# Altium project PCB_Project.PrjPcb
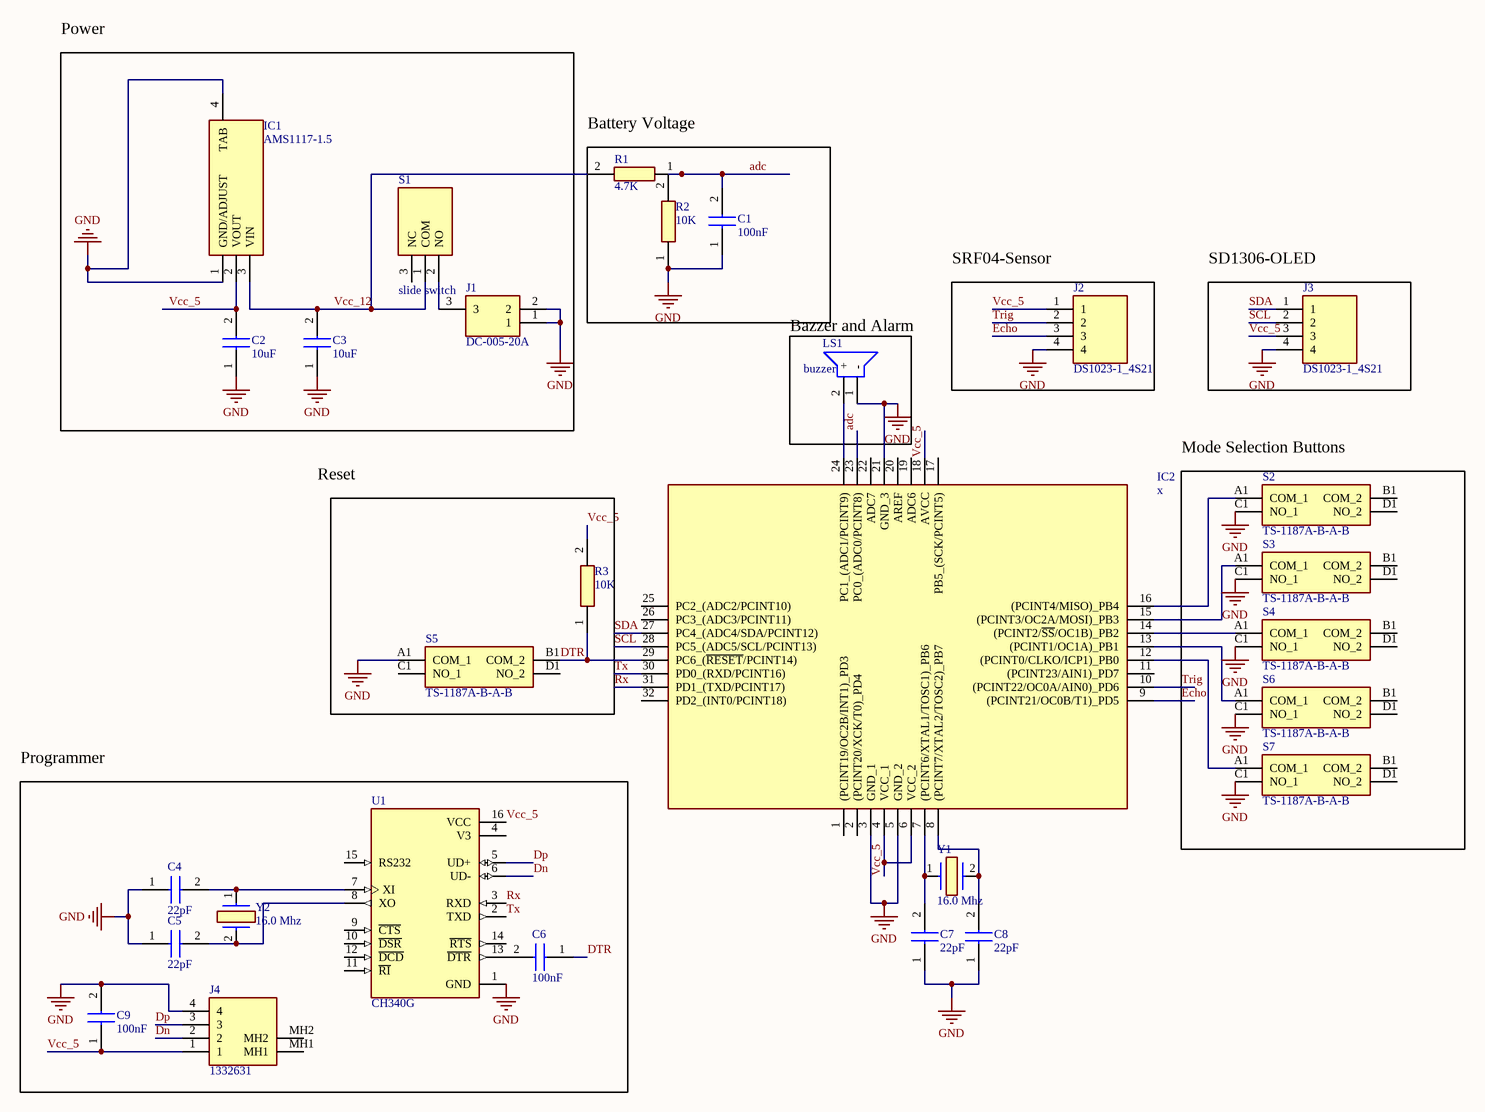
[diagram p0: Sheet1.SchDoc]
1 sheet, 29 parts. Net scope: global (net labels, ports and power ports of the same name join across sheets).
Board file: PCB1.PcbDoc

## Sheet Sheet1.SchDoc
size A3; SheetNumber: 1; SheetTotal: 1

### Parts
C1  100nF  [CAPC2012X130N]
C2  10uF  [CAPC2012X130N]
C3  10uF  [CAPC2012X130N]
C4  22pF  [CAPC2012X130N]
C5  22pF  [CAPC2012X130N]
C6  100nF  [CAPC2012X130N]
C7  22pF  [CAPC2012X130N]
C8  22pF  [CAPC2012X130N]
C9  100nF  [CAPC2012X130N]
IC1  AMS1117-1.5  [SOT229P700X180-4N]
IC2  x  [QFP80P900X900X120-32N]
J1  DC-005-20A  [DC00520A]
J2  DS1023-1_4S21  [RHDR4W60P0X254_1X4_1016X250X840P]
J3  DS1023-1_4S21  [RHDR4W60P0X254_1X4_1016X250X840P]
J4  1332631  [1332631]
LS1  buzzer  [CT1205SMTTR]
R1  4.7K  [RESC2012X60N]
R2  10K  [RESC2012X60N]
R3  10K  [RESC2012X60N]
S1  slide switch  [090329001]
S2  TS-1187A-B-A-B  [TS1187ABAB]
S3  TS-1187A-B-A-B  [TS1187ABAB]
S4  TS-1187A-B-A-B  [TS1187ABAB]
S5  TS-1187A-B-A-B  [TS1187ABAB]
S6  TS-1187A-B-A-B  [TS1187ABAB]
S7  TS-1187A-B-A-B  [TS1187ABAB]
U1  CH340G  [SOIC127P600X180-16N]
Y1  16.0 Mhz  [16000MHz49USMX3050408518pFATF]
Y2  16.0 Mhz  [16000MHz49USMX3050408518pFATF]

### Blocks framed on the sheet
Power: C2 C3 IC1 J1 S1
Battery Voltage: C1 R1 R2
SRF04-Sensor: J2
SD1306-OLED: J3
Bazzer and Alarm: LS1
Mode Selection Buttons: S2-S4 S6 S7
Programmer: C4-C6 C9 J4 U1 Y2

### Nets
GND: C1.1 C2.1 C3.1 C4.1 C5.1 C7.1 C8.1 C9.2 IC1.1(GND/ADJUST) IC1.4(TAB) IC2.3(GND_1) IC2.5(GND_2) IC2.21(GND_3) J1.1 J1.2 J2.4 J3.4 J4.4 LS1.1(-) R2.1 S2.C1(NO_1) S3.C1(NO_1) S4.C1(NO_1) S5.A1(COM_1) S6.C1(NO_1) S7.C1(NO_1) U1.1(GND)
adc: C1.2 IC2.23(PC0_(ADC0/PCINT8)) R1.1 R2.2
Dn: J4.2 U1.6(UD-)
Dp: J4.3 U1.5(UD+)
DTR: C6.1 IC2.29(PC6_(~{RESET}/PCINT14)) R3.1 S5.B1(COM_2)
Echo: IC2.9((PCINT21/OC0B/T1)_PD5) J2.3
Rx: IC2.31(PD1_(TXD/PCINT17)) U1.3(RXD)
SCL: IC2.28(PC5_(ADC5/SCL/PCINT13)) J3.2
SDA: IC2.27(PC4_(ADC4/SDA/PCINT12)) J3.1
Trig: IC2.10((PCINT22/OC0A/AIN0)_PD6) J2.2
Tx: IC2.30(PD0_(RXD/PCINT16)) U1.2(TXD)
Vcc_5: C2.2 C9.1 IC1.2(VOUT) IC2.4(VCC_1) IC2.6(VCC_2) IC2.18(AVCC) J2.1 J3.3 J4.1 R3.2 U1.16(VCC)
Vcc_12: C3.2 IC1.3(VIN) R1.2 S1.1(COM)
NetC4_2: C4.2 U1.7(XI) Y2.1
NetC5_2: C5.2 U1.8(XO) Y2.2
NetC6_2: C6.2 U1.13(~{DTR})
NetC7_2: C7.2 IC2.7((PCINT6/XTAL1/TOSC1)_PB6) Y1.1
NetC8_2: C8.2 IC2.8((PCINT7/XTAL2/TOSC2)_PB7) Y1.2
NetIC2_12: IC2.12((PCINT0/CLKO/ICP1)_PB0) S7.A1(COM_1)
NetIC2_13: IC2.13((PCINT1/OC1A)_PB1) S6.A1(COM_1)
NetIC2_14: IC2.14((PCINT2/~{SS}/OC1B)_PB2) S4.A1(COM_1)
NetIC2_15: IC2.15((PCINT3/OC2A/MOSI)_PB3) S3.A1(COM_1)
NetIC2_16: IC2.16((PCINT4/MISO)_PB4) S2.A1(COM_1)
NetIC2_24: IC2.24(PC1_(ADC1/PCINT9)) LS1.2(+)
NetJ1_3: J1.3 S1.2(NO)

Not connected (* = marked no-connect by the designer): IC2 1((PCINT19/OC2B/INT1)_PD3) 2((PCINT20/XCK/T0)_PD4) 11((PCINT23/AIN1)_PD7) 17(PB5_(SCK/PCINT5)) 19(ADC6) 20(AREF) 22(ADC7) 25(PC2_(ADC2/PCINT10)) 26(PC3_(ADC3/PCINT11)) 32(PD2_(INT0/PCINT18)); J4 MH1 MH2; S1 3(NC); S2 B1(COM_2) D1(NO_2); S3 B1(COM_2) D1(NO_2); S4 B1(COM_2) D1(NO_2); S5 C1(NO_1) D1(NO_2); S6 B1(COM_2) D1(NO_2); S7 B1(COM_2) D1(NO_2); U1 4(V3) 9(~{CTS}) 10(~{DSR}) 11(~{RI}) 12(~{DCD}) 14(~{RTS}) 15(RS232)

### Notes on the sheet
- Reset

### Library data of the parts
C1-C3 = 0805Y1000104KET: Capacitor; Manufacturer_Name: Knowles; Datasheet Link: http://docs-europe.electrocomponents.com/webdocs/119d/0900766b8119d7bc.pdf; Height: 1.3mm; Manufacturer_Part_Number: 0805Y1000104KET; Mouser Part Number: 843-0805Y1000104KET; Mouser Price/Stock: https://www.mouser.co.uk/ProductDetail/Knowles-Syfer/0805Y1000104KET?qs=HXFqYaX1Q2z9U%252BCIptEEYw%3D%3D
C4-C9 = 0805J050_0223MXE01: Capacitor; Manufacturer_Name: Knowles; Manufacturer_Part_Number: 0805J050 0223MXE01; Datasheet Link: http://docs-europe.electrocomponents.com/webdocs/119d/0900766b8119d7bc.pdf; Height: 1.3mm
IC1 = AMS1117-1.5: Integrated Circuit; Manufacturer_Name: ams OSRAM; Datasheet Link: http://www.advanced-monolithic.com/pdf/ds1117.pdf; Height: 1.8mm; Manufacturer_Part_Number: AMS1117-1.5
IC2 = ATMEGA328-AU: Integrated Circuit; Manufacturer_Name: Microchip; Datasheet Link: https://ww1.microchip.com/downloads/en/DeviceDoc/ATmega48A-PA-88A-PA-168A-PA-328-P-DS-DS40002061B.pdf; Height: 1.2mm; Manufacturer_Part_Number: ATMEGA328-AU; Mouser Part Number: 556-ATMEGA328-AU; Mouser Price/Stock: https://www.mouser.co.uk/ProductDetail/Microchip-Technology/ATMEGA328-AU?qs=lwdSMh1%2FoYJRHuGBjWz9Pg%3D%3D; Arrow Part Number: ATMEGA328-AU; Arrow Price/Stock: https://www.arrow.com/en/products/atmega328-au/microchip-technology?region=nac
J1 = DC-005-20A: Connector; Manufacturer_Name: Korean Hroparts Elec; Datasheet Link: https://datasheet.lcsc.com/szlcsc/Korean-Hroparts-Elec-DC-005-20A_C130239.pdf; Height: 11mm; Manufacturer_Part_Number: DC-005-20A
J2 J3 = DS1023-1_4S21: Connector; Manufacturer_Name: Connfly; Manufacturer_Part_Number: DS1023-1*4S21; Datasheet Link: https://www.tme.eu/Document/951e887d7e645db1a4e49e0834499c9b/zl262-sg.pdf; Height: 8.4mm
J4 = 1332631: Connector; Manufacturer_Name: Phoenix Contact; Datasheet Link: http://www.phoenixcontact.com/de/produkte/1332631; Height: 7.69mm; Manufacturer_Part_Number: 1332631
LS1 = CT-1205-SMT-TR: Loudspeaker or Buzzer; Manufacturer_Name: Same Sky; Datasheet Link: https://www.sameskydevices.com/product/resource/ct-1205-smt-tr.pdf; Height: 7.6mm; Manufacturer_Part_Number: CT-1205-SMT-TR; Mouser Part Number: 490-CT-1205-SMT-TR; Mouser Price/Stock: https://www.mouser.co.uk/ProductDetail/CUI-Devices/CT-1205-SMT-TR?qs=WyjlAZoYn53yMdK6PtX%2FVw%3D%3D; Arrow Part Number: CT-1205-SMT-TR; Arrow Price/Stock: https://www.arrow.com/en/products/ct-1205-smt-tr/cui-devices?region=nac
R1-R3 = CRCW080510K0FKEAHP: Resistor; Manufacturer_Name: Vishay; Datasheet Link: https://componentsearchengine.com/Datasheets/1/CRCW08051R00FKEAHP.pdf; Height: 0.6mm; Manufacturer_Part_Number: CRCW080510K0FKEAHP; Mouser Part Number: 71-CRCW080510K0FKEAH; Mouser Price/Stock: https://www.mouser.co.uk/ProductDetail/Vishay-Dale/CRCW080510K0FKEAHP?qs=FlFvgi4rxBybVOW6oiRQjA%3D%3D; Arrow Part Number: CRCW080510K0FKEAHP; Arrow Price/Stock: https://www.arrow.com/en/products/crcw080510k0fkeahp/vishay?utm_currency=USD&region=europe
S1 = 09.03290.01: Switch; Manufacturer_Name: EAO; Datasheet Link: https://www.mouser.co.uk/datasheet/2/628/EAO_1K2%20data%20sheet-1216079.pdf; Height: 7.9mm; Manufacturer_Part_Number: 09.03290.01; Mouser Part Number: 123-09.03290.01; Mouser Price/Stock: https://www.mouser.co.uk/ProductDetail/EAO/09.03290.01?qs=2pKMaj72wiFtSlc%252BiwXuGQ%3D%3D
S2-S7 = TS-1187A-B-A-B: Switch; Manufacturer_Name: XKB Connectivity; Datasheet Link: http://www.helloxkb.com/public/images/pdf/TS-1187A-X-X-X.pdf; Height: 4.05mm; Manufacturer_Part_Number: TS-1187A-B-A-B
U1 = CH340G: USB Interface Integrated Circuit; MF: WCH; Value: *; SnapEDA_Link: https://www.snapeda.com/parts/Ch340G/WCH/view-part/?ref=snap; MP: Ch340G; Check_prices: https://www.snapeda.com/parts/Ch340G/WCH/view-part/?ref=eda; Availability: Not in stock; Price: None; Package: None
Y1 Y2 = 16.000MHz_49USMX_30_50_-40+85_18pF_ATF: Crystal or Oscillator; Manufacturer_Name: EUROQUARTZ; Manufacturer_Part_Number: 16.000MHz 49USMX/30/50/-40+85/18pF/ATF; Datasheet Link: https://www.farnell.com/datasheets/75362.pdf; Height: 4.2mm